# EAGLE schematic fCPU (EAGLE 7.6.0)
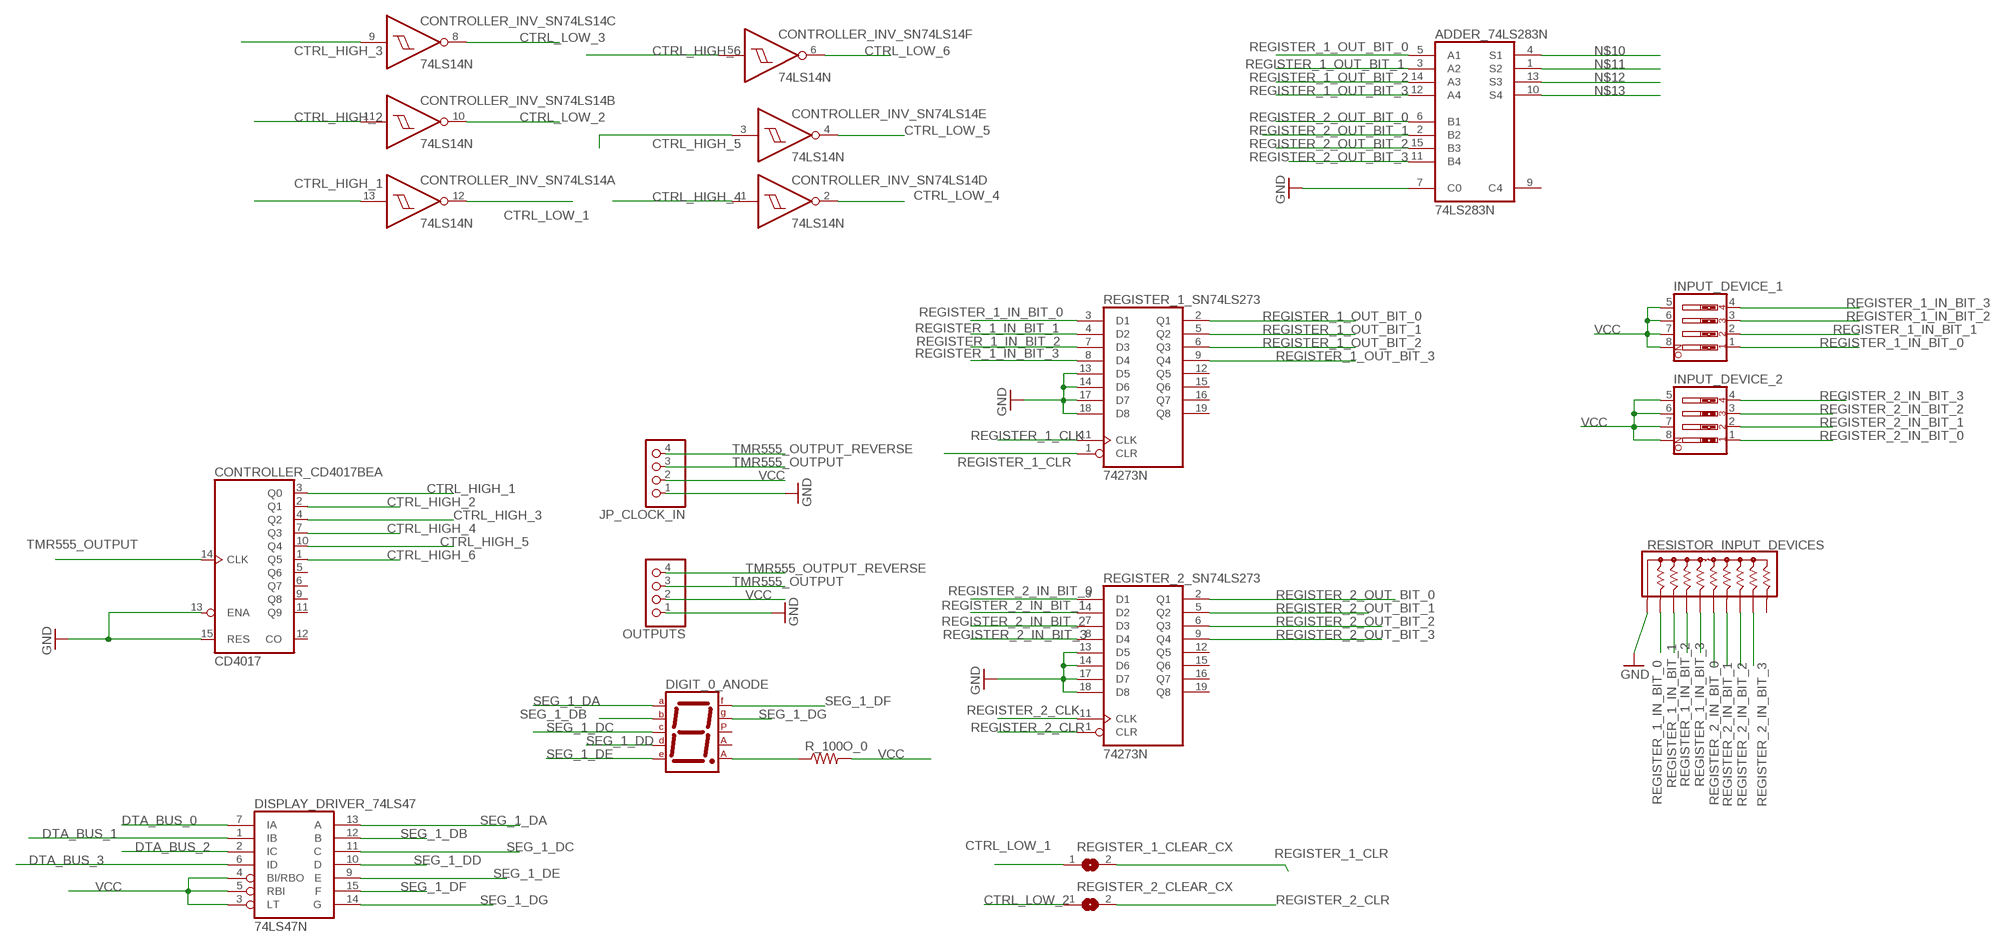
[diagram p0: schematic, sheet 1]

## Parts
ADDER_74LS283N  74LS283N  [DIL16]
CONTROLLER_CD4017BE  CD4017  [DIL16]
CONTROLLER_INV_SN74LS14  74LS14N  [DIL14]
DIGIT_0_ANODE  7SEG-CA  [7SEG-13]
DISPLAY_DRIVER_74LS47  74LS47N  [DIL16]
INPUT_DEVICE_1  SW_DIP-4  [EDG-04]
INPUT_DEVICE_2  SW_DIP-4  [EDG-04]
JP_CLOCK_IN  PINHD-1X4  [1X04]
OUTPUTS  PINHD-1X4  [1X04]
R_100O_0  R-US_R1206  [R1206]
REGISTER_1_CLEAR_CX  SOLDERJUMPERREFLOW  [SOLDERJUMPER_REFLOW]
REGISTER_1_SN74LS273  74273N  [DIL20]
REGISTER_2_CLEAR_CX  SOLDERJUMPERREFLOW  [SOLDERJUMPER_REFLOW]
REGISTER_2_SN74LS273  74273N  [DIL20]
RESISTOR_INPUT_DEVICES  4610X  [SIP10]

## Nets
CTRL_HIGH_1: CONTROLLER_CD4017BE.3(A:Q0) CONTROLLER_INV_SN74LS14.13(A:I)
CTRL_HIGH_2: CONTROLLER_CD4017BE.2(A:Q1) CONTROLLER_INV_SN74LS14.11(B:I)
CTRL_HIGH_3: CONTROLLER_CD4017BE.4(A:Q2) CONTROLLER_INV_SN74LS14.9(C:I)
CTRL_HIGH_4: CONTROLLER_CD4017BE.7(A:Q3) CONTROLLER_INV_SN74LS14.1(D:I)
CTRL_HIGH_5: CONTROLLER_CD4017BE.10(A:Q4) CONTROLLER_INV_SN74LS14.3(E:I)
CTRL_HIGH_6: CONTROLLER_CD4017BE.1(A:Q5) CONTROLLER_INV_SN74LS14.5(F:I)
CTRL_LOW_1: CONTROLLER_INV_SN74LS14.12(A:O) REGISTER_1_CLEAR_CX.1
CTRL_LOW_2: CONTROLLER_INV_SN74LS14.10(B:O) REGISTER_2_CLEAR_CX.1
CTRL_LOW_3: CONTROLLER_INV_SN74LS14.8(C:O)
CTRL_LOW_4: CONTROLLER_INV_SN74LS14.2(D:O)
CTRL_LOW_5: CONTROLLER_INV_SN74LS14.4(E:O)
CTRL_LOW_6: CONTROLLER_INV_SN74LS14.6(F:O)
DTA_BUS_0: DISPLAY_DRIVER_74LS47.7(IA)
DTA_BUS_1: DISPLAY_DRIVER_74LS47.1(IB)
DTA_BUS_2: DISPLAY_DRIVER_74LS47.2(IC)
DTA_BUS_3: DISPLAY_DRIVER_74LS47.6(ID)
GND: ADDER_74LS283N.7(C0) CONTROLLER_CD4017BE.13(A:ENA) CONTROLLER_CD4017BE.15(A:RES) JP_CLOCK_IN.1 OUTPUTS.1 REGISTER_1_SN74LS273.13(D5) REGISTER_1_SN74LS273.14(D6) REGISTER_1_SN74LS273.17(D7) REGISTER_1_SN74LS273.18(D8) REGISTER_2_SN74LS273.13(D5) REGISTER_2_SN74LS273.14(D6) REGISTER_2_SN74LS273.17(D7) REGISTER_2_SN74LS273.18(D8) RESISTOR_INPUT_DEVICES.1
N$1: DIGIT_0_ANODE.8(CA2) R_100O_0.1
N$10: ADDER_74LS283N.4(S1)
N$11: ADDER_74LS283N.1(S2)
N$12: ADDER_74LS283N.13(S3)
N$13: ADDER_74LS283N.10(S4)
REGISTER_1_CLK: REGISTER_1_SN74LS273.11(CLK)
REGISTER_1_CLR: REGISTER_1_CLEAR_CX.2 REGISTER_1_SN74LS273.1(CLR)
REGISTER_1_IN_BIT_0: INPUT_DEVICE_1.1 REGISTER_1_SN74LS273.3(D1) RESISTOR_INPUT_DEVICES.2
REGISTER_1_IN_BIT_1: INPUT_DEVICE_1.2 REGISTER_1_SN74LS273.4(D2) RESISTOR_INPUT_DEVICES.3
REGISTER_1_IN_BIT_2: INPUT_DEVICE_1.3 REGISTER_1_SN74LS273.7(D3) RESISTOR_INPUT_DEVICES.4
REGISTER_1_IN_BIT_3: INPUT_DEVICE_1.4 REGISTER_1_SN74LS273.8(D4) RESISTOR_INPUT_DEVICES.5
REGISTER_1_OUT_BIT_0: ADDER_74LS283N.5(A1) REGISTER_1_SN74LS273.2(Q1)
REGISTER_1_OUT_BIT_1: ADDER_74LS283N.3(A2) REGISTER_1_SN74LS273.5(Q2)
REGISTER_1_OUT_BIT_2: ADDER_74LS283N.14(A3) REGISTER_1_SN74LS273.6(Q3)
REGISTER_1_OUT_BIT_3: ADDER_74LS283N.12(A4) REGISTER_1_SN74LS273.9(Q4)
REGISTER_2_CLK: REGISTER_2_SN74LS273.11(CLK)
REGISTER_2_CLR: REGISTER_2_CLEAR_CX.2 REGISTER_2_SN74LS273.1(CLR)
REGISTER_2_IN_BIT_0: INPUT_DEVICE_2.1 REGISTER_2_SN74LS273.3(D1) RESISTOR_INPUT_DEVICES.6
REGISTER_2_IN_BIT_1: INPUT_DEVICE_2.2 REGISTER_2_SN74LS273.4(D2) RESISTOR_INPUT_DEVICES.7
REGISTER_2_IN_BIT_2: INPUT_DEVICE_2.3 REGISTER_2_SN74LS273.7(D3) RESISTOR_INPUT_DEVICES.8
REGISTER_2_IN_BIT_3: INPUT_DEVICE_2.4 REGISTER_2_SN74LS273.8(D4) RESISTOR_INPUT_DEVICES.9
REGISTER_2_OUT_BIT_0: ADDER_74LS283N.6(B1) REGISTER_2_SN74LS273.2(Q1)
REGISTER_2_OUT_BIT_1: ADDER_74LS283N.2(B2) REGISTER_2_SN74LS273.5(Q2)
REGISTER_2_OUT_BIT_2: ADDER_74LS283N.15(B3) REGISTER_2_SN74LS273.6(Q3)
REGISTER_2_OUT_BIT_3: ADDER_74LS283N.11(B4) REGISTER_2_SN74LS273.9(Q4)
SEG_1_DA: DIGIT_0_ANODE.7(A) DISPLAY_DRIVER_74LS47.13(A)
SEG_1_DB: DIGIT_0_ANODE.6(B) DISPLAY_DRIVER_74LS47.12(B)
SEG_1_DC: DIGIT_0_ANODE.4(C) DISPLAY_DRIVER_74LS47.11(C)
SEG_1_DD: DIGIT_0_ANODE.2(D) DISPLAY_DRIVER_74LS47.10(D)
SEG_1_DE: DIGIT_0_ANODE.1(E) DISPLAY_DRIVER_74LS47.9(E)
SEG_1_DF: DIGIT_0_ANODE.9(F) DISPLAY_DRIVER_74LS47.15(F)
SEG_1_DG: DIGIT_0_ANODE.10(G) DISPLAY_DRIVER_74LS47.14(G)
TMR555_OUTPUT: CONTROLLER_CD4017BE.14(A:CLK) JP_CLOCK_IN.3 OUTPUTS.3
TMR555_OUTPUT_REVERSE: JP_CLOCK_IN.4 OUTPUTS.4
VCC: DISPLAY_DRIVER_74LS47.3(LT) DISPLAY_DRIVER_74LS47.4(BI/RBO) DISPLAY_DRIVER_74LS47.5(RBI) INPUT_DEVICE_1.5 INPUT_DEVICE_1.6 INPUT_DEVICE_1.7 INPUT_DEVICE_1.8 INPUT_DEVICE_2.5 INPUT_DEVICE_2.6 INPUT_DEVICE_2.7 INPUT_DEVICE_2.8 JP_CLOCK_IN.2 OUTPUTS.2 R_100O_0.2
Unconnected: ADDER_74LS283N.9(C4) CONTROLLER_CD4017BE.5(A:Q6) CONTROLLER_CD4017BE.6(A:Q7) CONTROLLER_CD4017BE.9(A:Q8) CONTROLLER_CD4017BE.11(A:Q9) CONTROLLER_CD4017BE.12(A:CO) DIGIT_0_ANODE.3(CA1) DIGIT_0_ANODE.5(DP) REGISTER_1_SN74LS273.12(Q5) REGISTER_1_SN74LS273.15(Q6) REGISTER_1_SN74LS273.16(Q7) REGISTER_1_SN74LS273.19(Q8) REGISTER_2_SN74LS273.12(Q5) REGISTER_2_SN74LS273.15(Q6) REGISTER_2_SN74LS273.16(Q7) REGISTER_2_SN74LS273.19(Q8) RESISTOR_INPUT_DEVICES.10

## Power pins joined to a net without a drawn wire
GND: ADDER_74LS283N.8(GND) CONTROLLER_CD4017BE.8(P:GND) CONTROLLER_INV_SN74LS14.7(P:GND) DISPLAY_DRIVER_74LS47.8(GND) REGISTER_1_SN74LS273.10(GND) REGISTER_2_SN74LS273.10(GND)
VCC: ADDER_74LS283N.16(VCC) CONTROLLER_CD4017BE.16(P:VCC) CONTROLLER_INV_SN74LS14.14(P:VCC) DISPLAY_DRIVER_74LS47.16(VCC) REGISTER_1_SN74LS273.20(VCC) REGISTER_2_SN74LS273.20(VCC)

## Library data of the parts
ADDER_74LS283N = 74xx-us:74*283: 4-bit binary FULL ADDER, fast carry
CONTROLLER_CD4017BE = SparkFun-DigitalIC:CD4017; PROD_ID: IC-11929
CONTROLLER_INV_SN74LS14 = 74xx-us:74*14: Hex schmitt trigger INVERTER
DIGIT_0_ANODE = special:7SEG-CA: 7-segment DISPLAY single anode, 13 mm
DISPLAY_DRIVER_74LS47 = 74xx-us:74*47: BCD to seven segment DECODER/DRIVER Source: http://www.ee.washington.edu/stores/DataSheets/74ls/74ls47.pdf
INPUT_DEVICE_1 INPUT_DEVICE_2 = special:SW_DIP-4: DIP SWITCH
JP_CLOCK_IN OUTPUTS = pinhead:PINHD-1X4: PIN HEADER
R_100O_0 = adafruit:R-US_: RESISTOR, American symbol
REGISTER_1_CLEAR_CX REGISTER_2_CLEAR_CX = microbuilder:SOLDERJUMPER: SMD Solder JUMPER Solder the two pads together to create a connection, or remove the solder to break it. REFLOW - Use this footprint for solder paste and reflow ovens. WAVE - Use this footprint for hand-soldering (larger pads). CLOSED - Has a trace between the two pads to ensure it is closed by default. The trace needs to be cut to disable the jumper, and can be closed again by creating a solder bridge between the two pads.
REGISTER_1_SN74LS273 REGISTER_2_SN74LS273 = 74xx-us:74*273: Octal D type FLIP FLOP, clear
RESISTOR_INPUT_DEVICES = resistor-sip:4610X: Bourns 4600X Series - Thick Film Conformal SIPs 4610X-101 Resistor Network Configuration: 101 (Bussed Resistors) Resistance range: 10 ohms to 10 Megaohms Maximum Operating Voltage: 100V Source: http://www.bourns.com/ProductLine.aspx?name=standard_thick_film_networks PDF: http://www.bourns.com/data/global/pdfs/4600X.pdf